# Altium schematic sheet Sheet1.SchDoc
size A; SheetNumber: 1; SheetTotal: 1
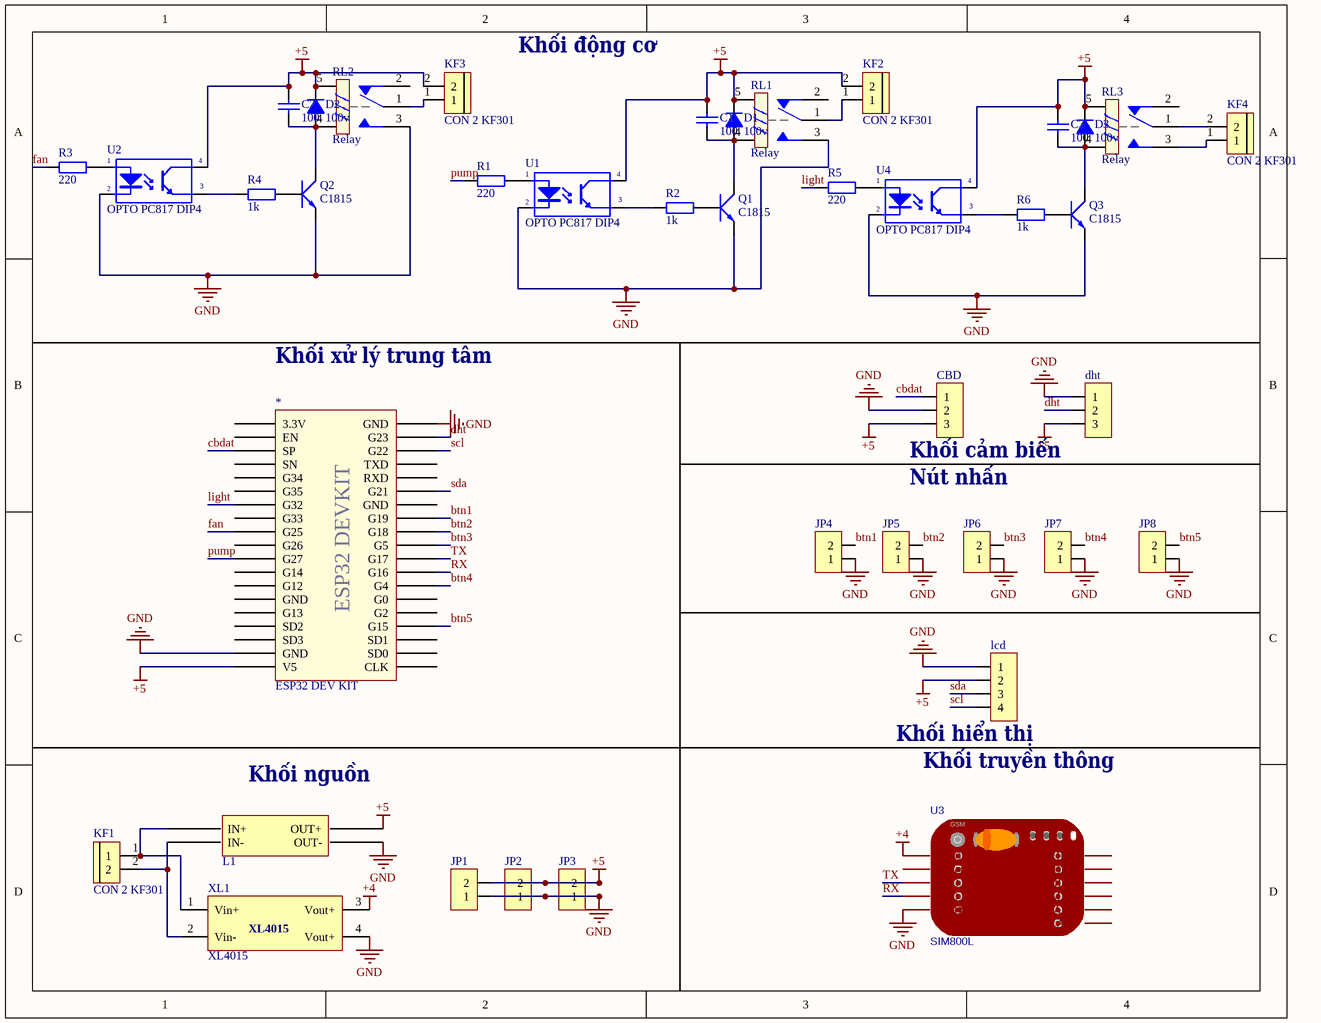
[diagram p0: Sheet1.SchDoc]

## Parts
*  ESP32 DEV KIT  [ESP32 DEVKIT]
C1  100  [tu gom]
C2  100  [tu gom]
C3  100  [tu gom]
CBD  JP 1x3 2.54  [JP 1x3 DT]  (value not drawn)
D1  100v  [DIODE 1A]
D2  100v  [DIODE 1A]
D3  100v  [DIODE 1A]
dht  JP 1x3 2.54  [JP 1x3 DT]  (value not drawn)
JP1  JP 1x2 2.54  [JP 1x2 DT]  (value not drawn)
JP2  JP 1x2 2.54  [JP 1x2 DT]  (value not drawn)
JP3  JP 1x2 2.54  [JP 1x2 DT]  (value not drawn)
JP4  JP 1x2 2.54  [JP 1x2 DT]  (value not drawn)
JP5  JP 1x2 2.54  [JP 1x2 DT]  (value not drawn)
JP6  JP 1x2 2.54  [JP 1x2 DT]  (value not drawn)
JP7  JP 1x2 2.54  [JP 1x2 DT]  (value not drawn)
JP8  JP 1x2 2.54  [JP 1x2 DT]  (value not drawn)
KF1  CON 2 KF301  [Con 2 KF301 5.08]
KF2  CON 2 KF301  [Con 2 KF301 5.08]
KF3  CON 2 KF301  [Con 2 KF301 5.08]
KF4  CON 2 KF301  [Con 2 KF301 5.08]
L1  BUCK_LM2596  [BUCK_LM2596]  (value not drawn)
lcd  JP 1x4 2.54  [JP 1x4 DT]  (value not drawn)
Q1  C1815  [TO92]
Q2  C1815  [TO92]
Q3  C1815  [TO92]
R1  220  [tro vach 1/4w]
R2  1k  [tro vach 1/4w]
R3  220  [tro vach 1/4w]
R4  1k  [tro vach 1/4w]
R5  220  [tro vach 1/4w]
R6  1k  [tro vach 1/4w]
RL1  Relay  [Relay 5 Chan SRD]
RL2  Relay  [Relay 5 Chan SRD]
RL3  Relay  [Relay 5 Chan SRD]
U1  OPTO PC817 DIP4  [DIP4]
U2  OPTO PC817 DIP4  [DIP4]
U3  SIM800L  [SIM800L MODULE]
U4  OPTO PC817 DIP4  [DIP4]
XL1  XL4015  [XL4015]

## Nets
+4: U3.1(VCC) XL1.3(Vout+)
+5: *.19(V5) C1.1 C2.1 C3.1 CBD.3 D1.2(K) D2.2(K) D3.2(K) dht.3 JP1.2 JP2.2 JP3.2 KF2.2 KF3.2 L1.4(OUT+) lcd.2 RL1.5 RL2.5 RL3.5 U1.4(C) U2.4(C) U4.4(C)
GND: *.18(GND) *.38(GND) CBD.2 dht.1 JP1.1 JP2.1 JP3.1 JP4.1 JP5.1 JP6.1 JP7.1 JP8.1 L1.3(OUT-) lcd.1 Q1.1(E) Q2.1(E) Q3.1(E) RL1.3 RL2.3 U1.2(K) U2.2(K) U3.5(GND) U4.2(K) XL1.4(Vout+)
btn1: *.31(G19) JP4.2
btn2: *.30(G18) JP5.2
btn3: *.29(G5) JP6.2
btn4: *.26(G4) JP7.2
btn5: *.23(G15) JP8.2
cbdat: *.3(SP) CBD.1
dht: *.37(G23) dht.2
fan: *.9(G25) R3.1
light: *.7(G32) R5.1
pump: *.11(G27) R1.1
RX: *.27(G16) U3.4(TxD)
scl: *.36(G22) lcd.4
sda: *.33(G21) lcd.3
TX: *.28(G17) U3.3(RxD)
NetC1_2: C1.2 D1.1(A) Q1.2(C) RL1.4
NetC2_2: C2.2 D2.1(A) Q2.2(C) RL2.4
NetC3_2: C3.2 D3.1(A) Q3.2(C) RL3.4
NetKF1_1: KF1.1 L1.1(IN+) XL1.1(Vin+)
NetKF1_2: KF1.2 L1.2(IN-) XL1.2(Vin-)
NetKF2_1: KF2.1 RL1.1
NetKF3_1: KF3.1 RL2.1
NetKF4_1: KF4.1 RL3.3
NetKF4_2: KF4.2 RL3.1
NetQ1_3: Q1.3(B) R2.2
NetQ2_3: Q2.3(B) R4.2
NetQ3_3: Q3.3(B) R6.2
NetR1_2: R1.2 U1.1(A)
NetR2_1: R2.1 U1.3(E)
NetR3_2: R3.2 U2.1(A)
NetR4_1: R4.1 U2.3(E)
NetR5_2: R5.2 U4.1(A)
NetR6_1: R6.1 U4.3(E)

Not connected (* = marked no-connect by the designer): * 1(3.3V) 2(EN) 4(SN) 5(G34) 6(G35) 8(G33) 10(G26) 12(G14) 13(G12) 14(GND) 15(G13) 16(SD2) 17(SD3) 20(CLK) 21(SD0) 22(SD1) 24(G2) 25(G0) 32(GND) 34(RXD) 35(TXD); RL1 2; RL2 2; RL3 2; U3 2(Reset) 6(RIRG) 7(DTR) 8(MIC+) 9(MIC-) 10(EAR+) 11(EAR-)

## Notes on the sheet
- Khối động cơ
- Khối xử lý trung tâm
- (near CBD) Khối cảm biến
- Nút nhấn
- (near lcd) Khối hiển thị
- (near lcd) Khối truyền thông
- (near L1) Khối nguồn
- (in symbol ESP32 DEV KIT) ESP32 DEVKIT
- (in symbol SIM800L) GSM

## Library data of the parts
C1-C3 = Tu gom 100 50V: Cắm; Don_Vi: Con; So_Chan: 2; Ten_Linh_Kien: Tụ gốm 100 10pF 50V; Ma_Hang: MH004765; Chung_Loai: Cắm; Kieu_Chan: *
CBD dht = JP 1x3 2.54 Duc Thang: Cắm; Ten_Linh_Kien: Jump Đơn Đực 2.54MM 1x40P Thẳng 11MM; Don_Vi: Con; Ma_Hang: MH000903; Ghi_Chu: *; Kieu_Chan: *; Chung_Loai: Cắm
D1-D3 = Diode 1N4007: Cắm; Ten_Linh_Kien: Diode 1N4007 1A (DIP); Don_Vi: Con; Ma_Hang: MH001063; Ghi Chu: *; Kieu_Chan: *; Chung_Loai: Cắm
JP1-JP8 = JP 1x2 2.54 Duc Thang: Cắm; Ten_Linh_Kien: Jump Đơn Đực 2.54MM 1x40P Thẳng 11MM; Don_Vi: Con; Ma_Hang: MH000903; Ghi_Chu: *; Kieu_Chan: *; Chung_Loai: Cắm
KF1-KF4 = CON 2 KF301: Cắm; Ma_Hang: MH000987; Ten_Linh_Kien: CON 2 KF301-2P 5.08MM Xanh Dương; Chung_Loai: Cắm; Ghi_Chu: *; Kieu_Chan: *; Don_Vi: Con
lcd = JP 1x4 2.54 Duc Thang: Cắm; Ten_Linh_Kien: Jump Đơn Đực 2.54MM 1x40P Thẳng 11MM; Don_Vi: Con; Ma_Hang: MH000903; Ghi_Chu: *; Kieu_Chan: *; Chung_Loai: Cắm
Q1-Q3 = C1815: NPN transistor; Value: C9014
R1-R6 = Tro Vach 1/4W 5% 1.2R: Cắm; Don_Vi: Con; So_Chan: 2; Ten_Linh_Kien: Trở Vạch 1/4w 5% 1.2R; Ma_Hang: MH007350; Chung_Loai: Cắm; Kieu_Chan: *
RL1-RL3 = Relay 5 Chan SRD: Relay 5 Chan; Ma_Hang: MH009374; Ten: Relay 5V10A SRD-05VDC-SL-C Chính Hãng
U1 U2 U4 = OPTO PC817 DIP4: Single Opto; Value: PC817
U3 = SIM800L: sourceId: ega4lDVPJ; Contributor: trigui; timeStamp: 1475502242; BOM_Supplier Part: B01DLIJM2E; BOM_Supplier: Amazon; spicePre: U